# Altium schematic sheet LCD_Display.SchDoc
size A4; SheetNumber: 3; SheetTotal: 5
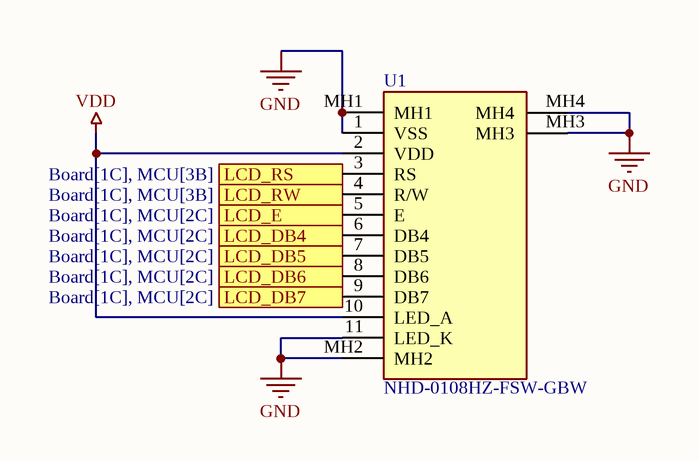
[diagram p0: LCD_Display.SchDoc]

## Parts
U1  NHD-0108HZ-FSW-GBW  [NHD0108HZFSWGBW]

## Ports
LCD_DB4 (in, see Board[1C], MCU[2C]), LCD_DB5 (in, see Board[1C], MCU[2C]), LCD_DB6 (in, see Board[1C], MCU[2C]), LCD_DB7 (in, see Board[1C], MCU[2C]), LCD_E (in, see Board[1C], MCU[2C]), LCD_RS (in, see Board[1C], MCU[3B]), LCD_RW (in, see Board[1C], MCU[3B])

## Nets
GND: U1.1(VSS) U1.11(LED_K) U1.MH1 U1.MH2 U1.MH3 U1.MH4
VDD: U1.2(VDD) U1.10(LED_A)
LCD_DB4: U1.6(DB4) ; port LCD_DB4
LCD_DB5: U1.7(DB5) ; port LCD_DB5
LCD_DB6: U1.8(DB6) ; port LCD_DB6
LCD_DB7: U1.9(DB7) ; port LCD_DB7
LCD_E: U1.5(E) ; port LCD_E
LCD_RS: U1.3(RS) ; port LCD_RS
LCD_RW: U1.4(R/W) ; port LCD_RW

## Library data of the parts
U1 = NHD-0108HZ-FSW-GBW: Display; Manufacturer_Name: Newhaven Display; Datasheet Link: https://componentsearchengine.com/Datasheets/1/NHD-0108HZ-FSW-GBW.pdf; Height: 6.25mm; Manufacturer_Part_Number: NHD-0108HZ-FSW-GBW; Mouser Part Number: 763-0108HZ-FSW-GBW; Mouser Price/Stock: https://www.mouser.co.uk/ProductDetail/Newhaven-Display/NHD-0108HZ-FSW-GBW?qs=3vk7fz9CmNzWmNqjoshRyQ%3D%3D